# Altium schematic sheet PART2.SchDoc
size 558 x 431 mm
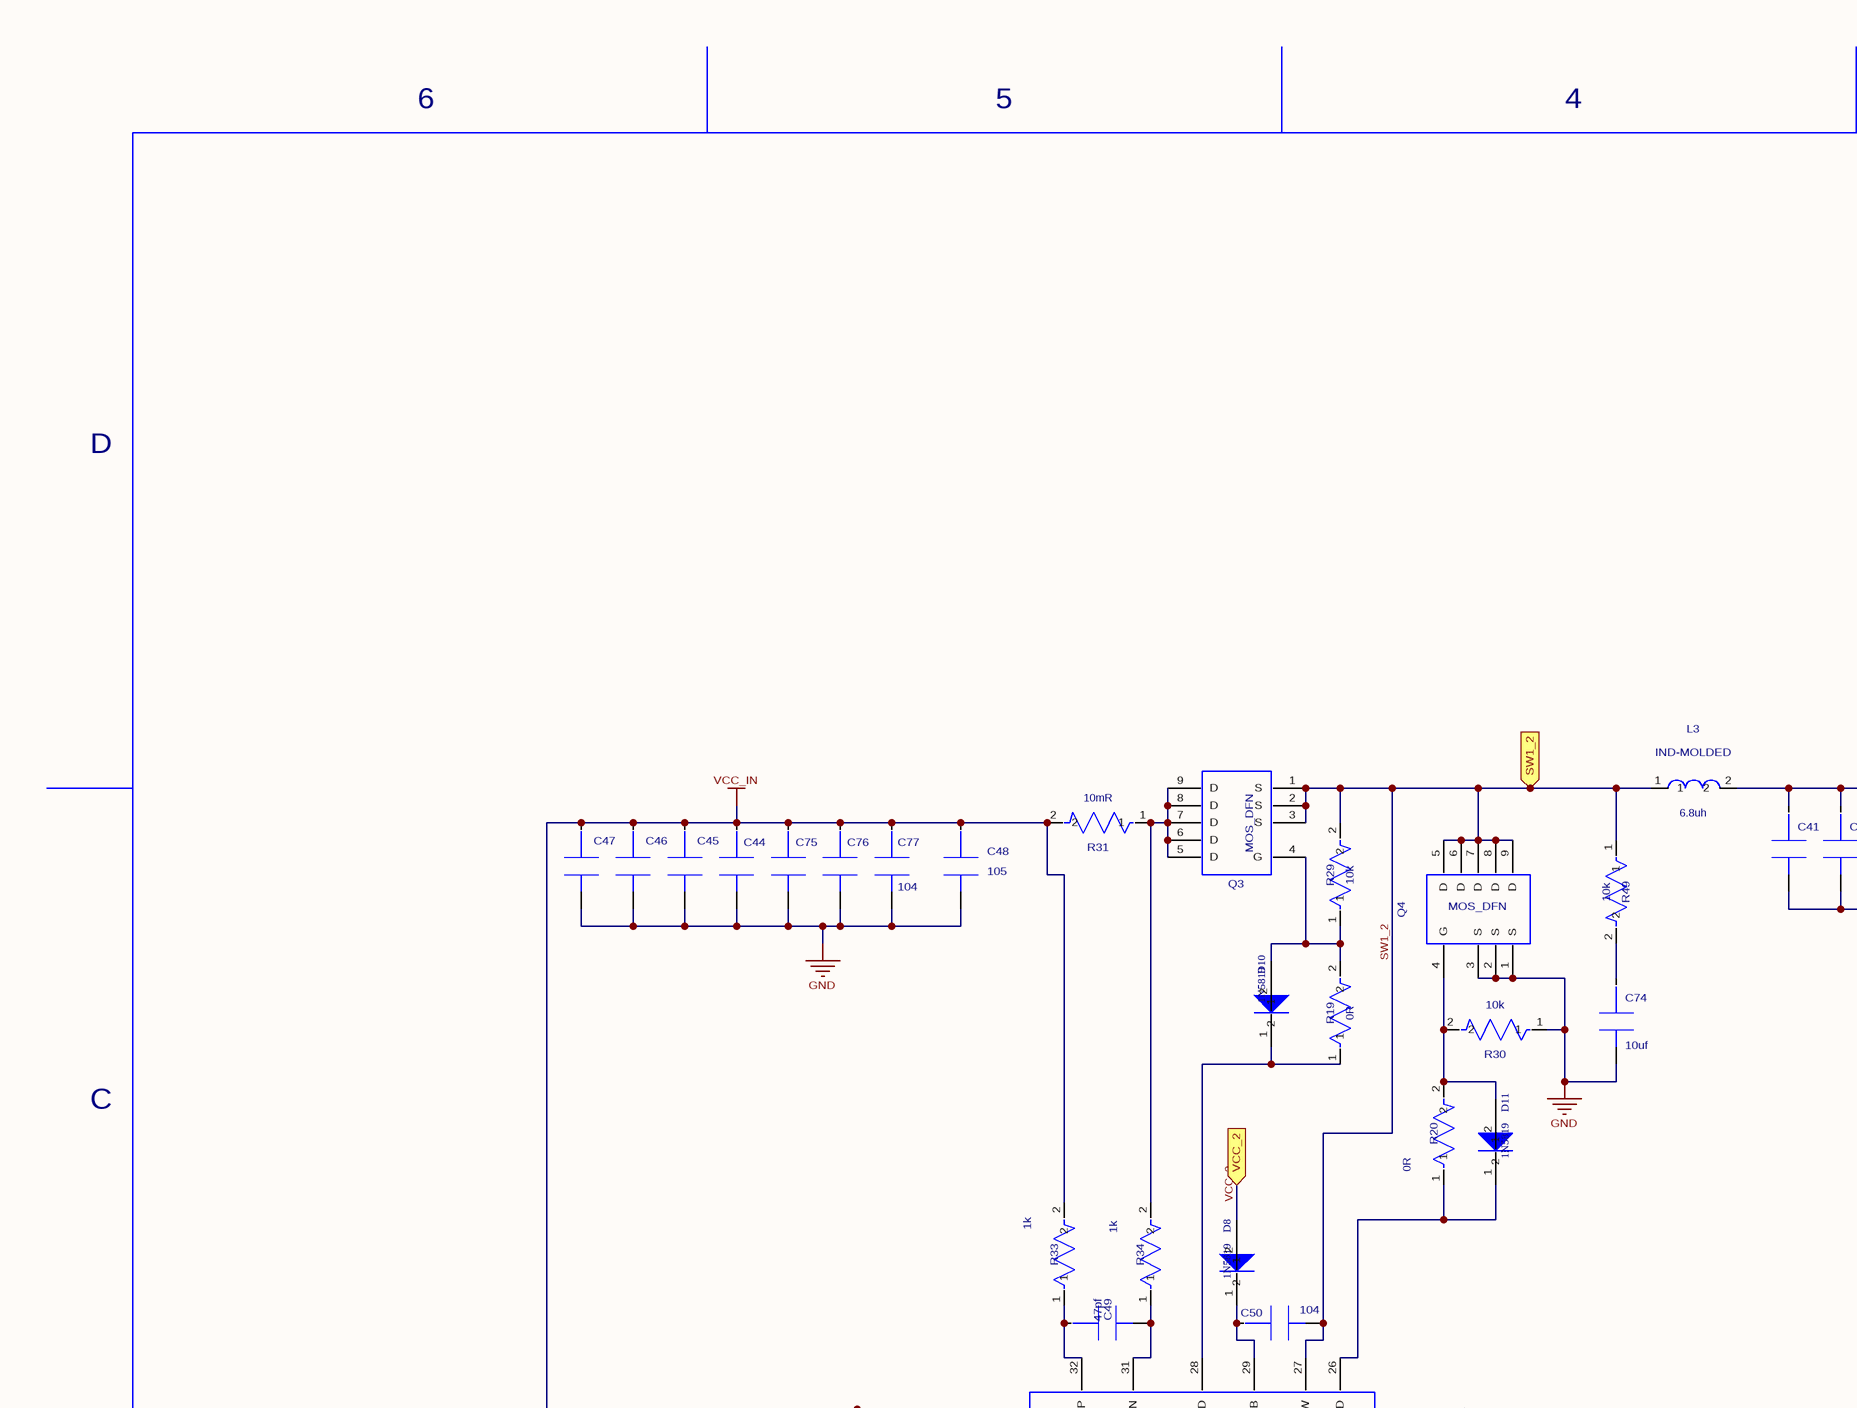
[diagram p0: PART2.SchDoc, top left]
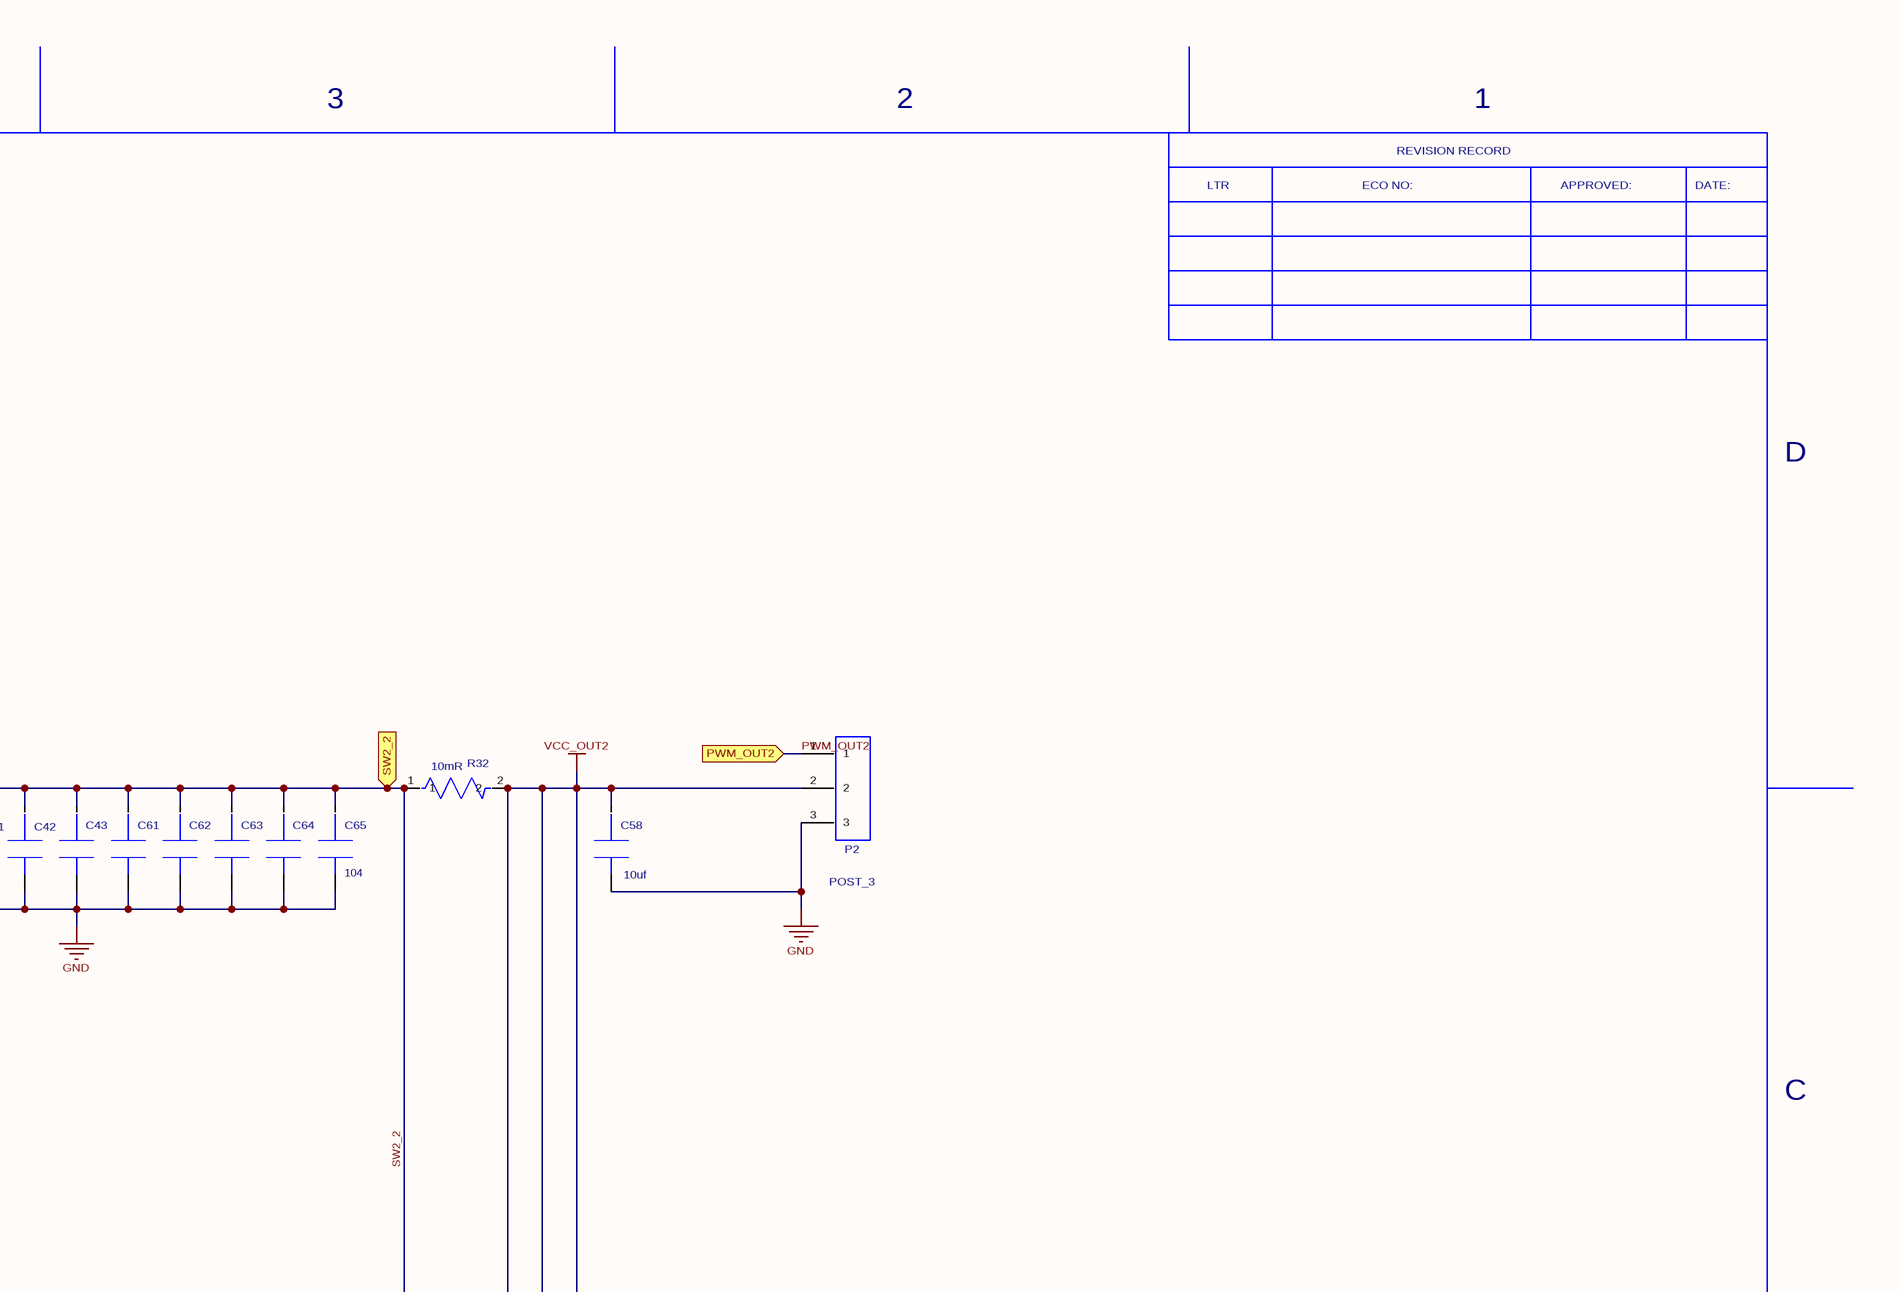
[diagram p1: PART2.SchDoc, top right]
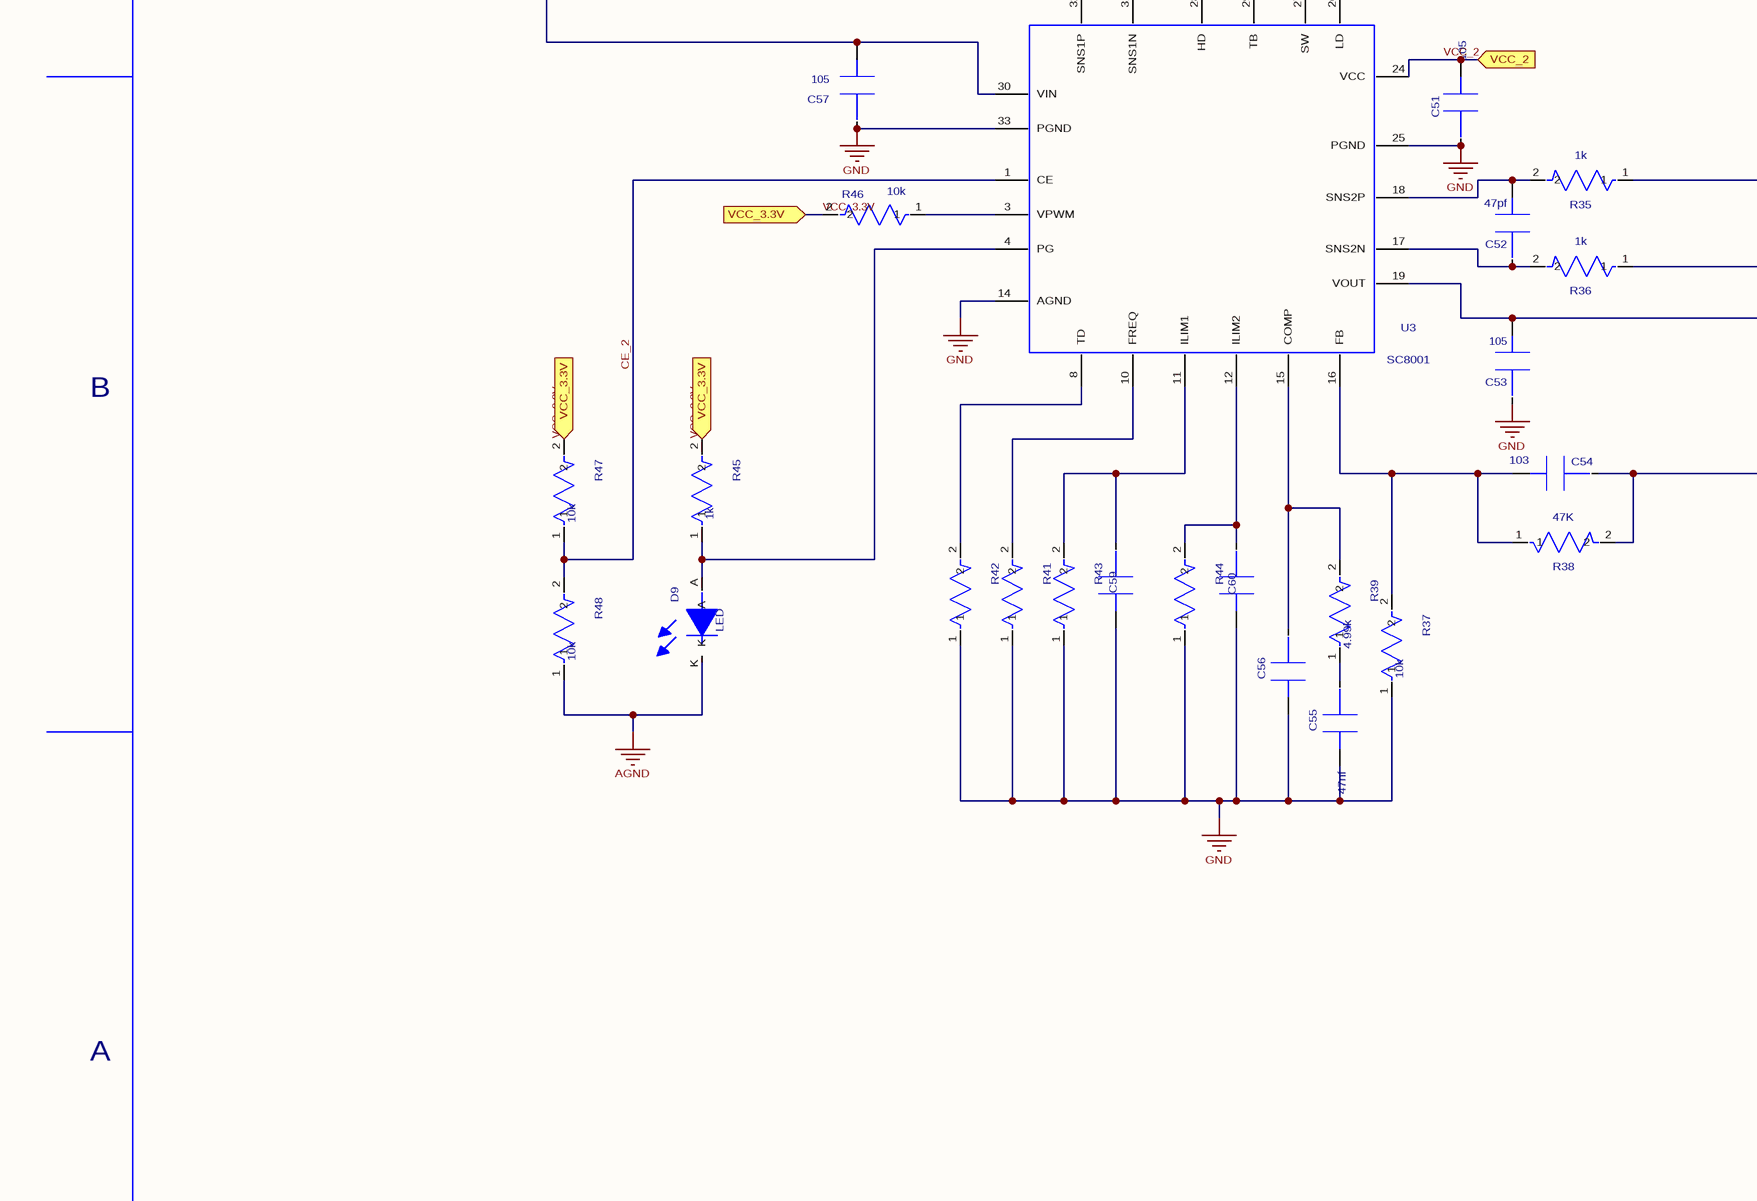
[diagram p2: PART2.SchDoc, bottom left]
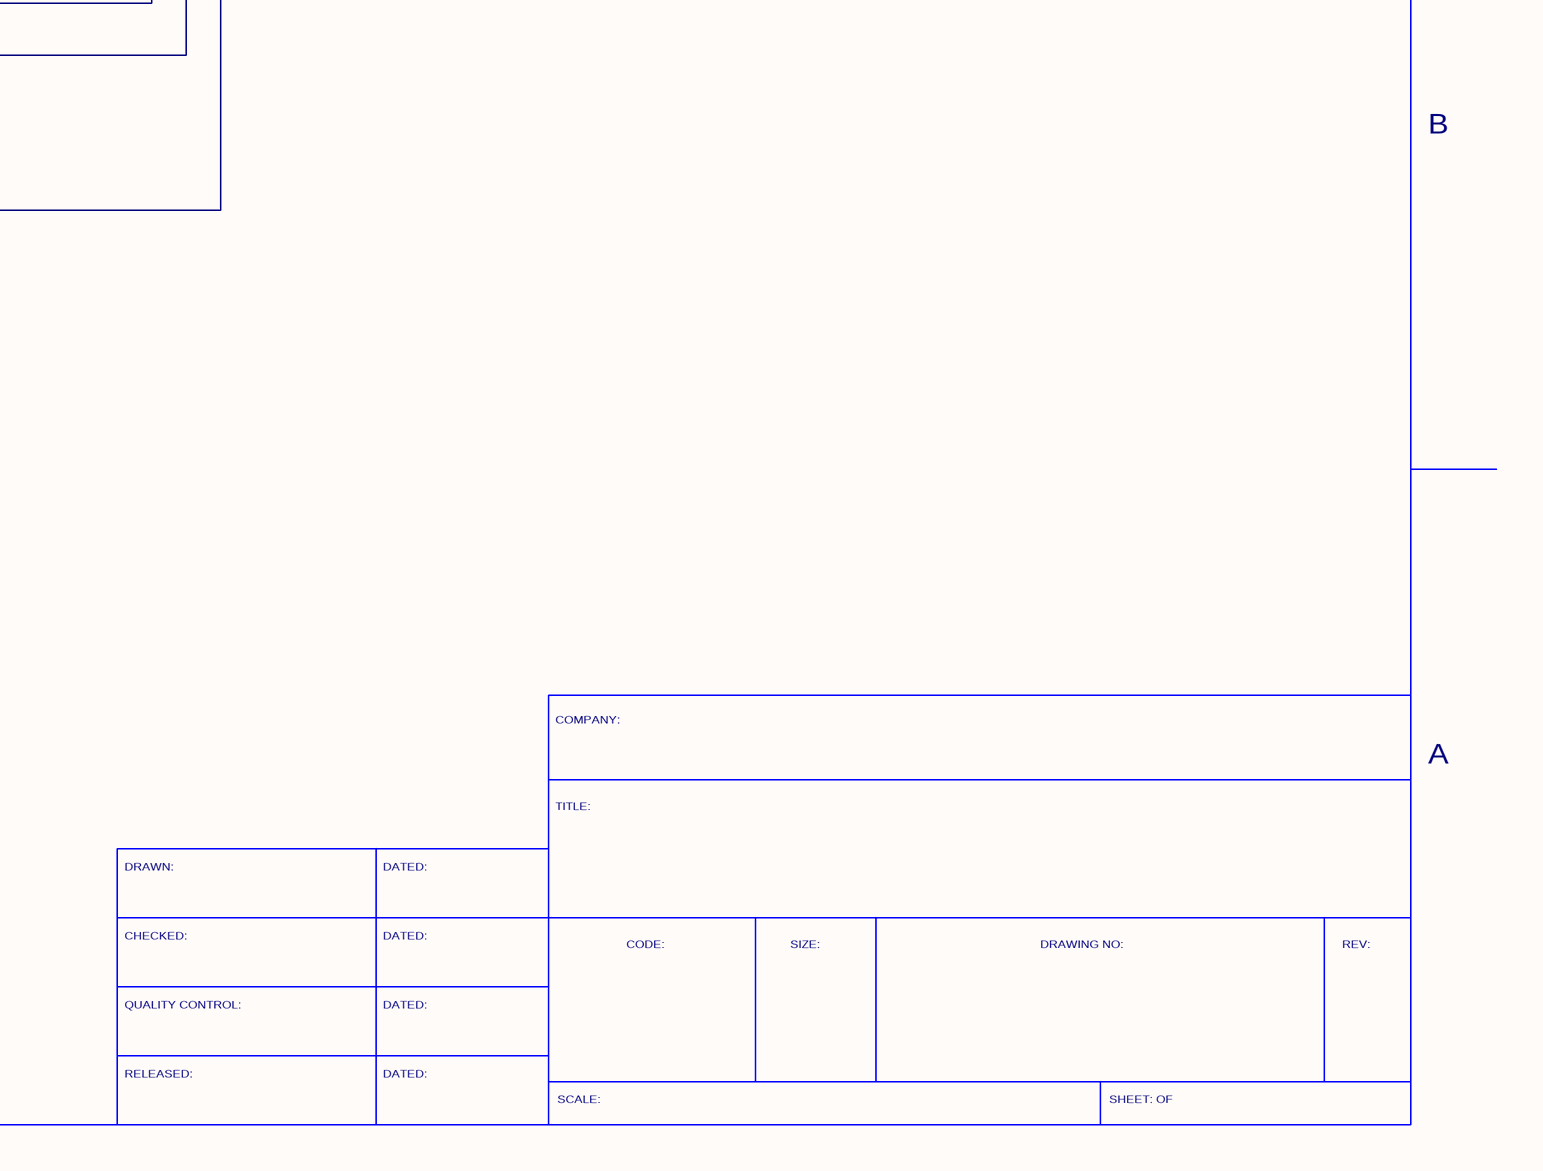
[diagram p3: PART2.SchDoc, bottom right]

## Parts
C41  CAP-AE6.3  [CC6.56.5]  (value not drawn)
C42  CAP-AE6.3  [CC6.56.5]  (value not drawn)
C43  CAP-CFR04R-C  [1206C]  (value not drawn)
C44  CAP-CFR04R-C  [1210C]  (value not drawn)
C45  CAP-CFR04R-C  [1210C]  (value not drawn)
C46  CAP-CFR04R-C  [1206C]  (value not drawn)
C47  CAP-CFR04R-C  [1210C]  (value not drawn)
C48  value 105  [0805C]  (hidden comment: CAP-CFR04R-C)
C49  value 47pf  [0603C]  (hidden comment: CAP-CFR04R-C)
C50  value 104  [0805C]  (hidden comment: CAP-CFR04R-C)
C51  value 105  [0805C]  (hidden comment: CAP-CFR04R-C)
C52  value 47pf  [0603C]  (hidden comment: CAP-CFR04R-C)
C53  value 105  [0805C]  (hidden comment: CAP-CFR04R-C)
C54  value 103  [0603C]  (hidden comment: CAP-CFR04R-C)
C55  value 47nf  [0603C]  (hidden comment: CAP-CFR04R-C)
C56  CAP-CFR04R-C  [0603C]  (value not drawn)
C57  value 105  [0805C]  (hidden comment: CAP-CFR04R-C)
C58  value 10uf  [1206C]  (hidden comment: CAP-CFR04R-C)
C59  CAP-CFR04R-C  [0603C]  (value not drawn)
C60  CAP-CFR04R-C  [0603C]  (value not drawn)
C61  CAP-CFR04R-C  [1206C]  (value not drawn)
C62  CAP-CFR04R-C  [1206C]  (value not drawn)
C63  CAP-CFR04R-C  [1206C]  (value not drawn)
C64  CAP-CFR04R-C  [1206C]  (value not drawn)
C65  value 104  [1206C]  (hidden comment: CAP-CFR04R-C)
C74  value 10uf  [0805C]  (hidden comment: CAP-CFR04R-C)
C75  CAP-CFR04R-C  [1210C]  (value not drawn)
C76  CAP-CFR04R-C  [1210C]  (value not drawn)
C77  value 104  [0805C]  (hidden comment: CAP-CFR04R-C)
D8  DIODE_1N4148  [SOD-123_L2.8-W1.8-LS3.7-RD]  (value not drawn)
D9  LED  [0805D]
D10  DIODE_1N4148  [SOD-123_L2.8-W1.8-LS3.7-RD]  (value not drawn)
D11  DIODE_1N4148  [SOD-123_L2.8-W1.8-LS3.7-RD]  (value not drawn)
L3  IND-MOLDED  value 6.8uh  [1040L]
P2  POST_3  [POST_3]
Q3  MOS_DFN  [DFN-8_5X6]
Q4  MOS_DFN  [DFN-8_5X6]
R19  value 0R  [0603R]  (hidden comment: RES-WR1)
R20  value 0R  [0603R]  (hidden comment: RES-WR1)
R29  value 10k  [0603R]  (hidden comment: RES-WR1)
R30  value 10k  [0603R]  (hidden comment: RES-WR1)
R31  value 10mR  [1206C]  (hidden comment: RES-WR1)
R32  value 10mR  [1206C]  (hidden comment: RES-WR1)
R33  value 1k  [0603R]  (hidden comment: RES-WR1)
R34  value 1k  [0603R]  (hidden comment: RES-WR1)
R35  value 1k  [0603R]  (hidden comment: RES-WR1)
R36  value 1k  [0603R]  (hidden comment: RES-WR1)
R37  value 10k  [0603R]  (hidden comment: RES-WR1)
R38  value 47K  [0603R]  (hidden comment: RES-WR1)
R39  value 4.99k  [0603R]  (hidden comment: RES-WR1)
R41  RES-WR1  [0603R]  (value not drawn)
R42  RES-WR1  [0603R]  (value not drawn)
R43  RES-WR1  [0603R]  (value not drawn)
R44  RES-WR1  [0603R]  (value not drawn)
R45  value 1k  [0805R]  (hidden comment: RES-WR1)
R46  value 10k  [0805R]  (hidden comment: RES-WR1)
R47  value 10k  [0805R]  (hidden comment: RES-WR1)
R48  value 10k  [0805R]  (hidden comment: RES-WR1)
R49  value 10k  [1206C]  (hidden comment: RES-WR1)
U3  SC8001  [QFN-32_L4.0-W4.0-P0.40-BL-EP2.7]

## Ports
PWM_OUT2, SW1_2, SW2_2, VCC_2, VCC_3.3V

## Nets
AGND: D9.K R48.1
GND: C41.2 C42.2 C43.2 C44.2 C45.2 C46.2 C47.2 C48.2 C51.1 C53.1 C55.2 C56.2 C57.1 C58.2 C59.2 C60.2 C61.2 C62.2 C63.2 C64.2 C65.2 C74.2 C75.2 C76.2 C77.2 P2.3 Q4.1(S) Q4.2(S) Q4.3(S) R30.1 R37.1 R41.1 R42.1 R43.1 R44.1 U3.14(AGND) U3.25(PGND) U3.33(PGND)
VCC_IN: C44.1 C45.1 C46.1 C47.1 C48.1 C57.2 C75.1 C76.1 C77.1 R31.2 R33.2 U3.30(VIN)
VCC_OUT2: C53.2 C54.1 C58.1 P2.2 R32.2 R36.1 R38.2 U3.19(VOUT)
CE_2: R47.1 R48.2 U3.1(CE)
PWM_OUT2: P2.1 ; port PWM_OUT2
SW1_2: C50.2 L3.1 Q3.1(S) Q3.2(S) Q3.3(S) Q4.5(D) Q4.6(D) Q4.7(D) Q4.8(D) Q4.9(D) R29.2 R49.1 U3.27(SW) ; port SW1_2
SW2_2: C41.1 C42.1 C43.1 C61.1 C62.1 C63.1 C64.1 C65.1 L3.2 R32.1 R35.1 ; port SW2_2
VCC_2: C51.2 D8.2 U3.24(VCC) ; port VCC_2
VCC_3.3V: R45.2 R46.2 R47.2 ; port VCC_3.3V
NetC49_1: C49.1 R33.1 U3.32(SNS1P)
NetC49_2: C49.2 R34.1 U3.31(SNS1N)
NetC50_1: C50.1 D8.1 U3.29(TB)
NetC52_1: C52.1 R36.2 U3.17(SNS2N)
NetC52_2: C52.2 R35.2 U3.18(SNS2P)
NetC54_2: C54.2 R37.2 R38.1 U3.16(FB)
NetC55_1: C55.1 R39.1
NetC56_1: C56.1 R39.2 U3.15(COMP)
NetC59_1: C59.1 R43.2 U3.11(ILIM1)
NetC60_1: C60.1 R44.2 U3.12(ILIM2)
NetC74_1: C74.1 R49.2
NetD9_A: D9.A R45.1 U3.4(PG)
NetD10_1: D10.1 R19.1 U3.28(HD)
NetD10_2: D10.2 Q3.4(G) R19.2 R29.1
NetD11_1: D11.1 R20.1 U3.26(LD)
NetD11_2: D11.2 Q4.4(G) R20.2 R30.2
NetQ3_5: Q3.5(D) Q3.6(D) Q3.7(D) Q3.8(D) Q3.9(D) R31.1 R34.2
NetR41_2: R41.2 U3.10(FREQ)
NetR42_2: R42.2 U3.8(TD)
NetR46_1: R46.1 U3.3(VPWM)

## Notes on the sheet
- 6
- 5
- 4
- 3
- 2
- 1
- LTR
- ECO NO:
- REVISION RECORD
- APPROVED:
- DATE:
- D
- C
- B
- COMPANY:
- A
- TITLE:
- DRAWN:
- DATED:
- CHECKED:
- CODE:
- SIZE:
- DRAWING NO:
- REV:
- QUALITY CONTROL:
- RELEASED:
- SCALE:
- SHEET: OF

## Library data of the parts
C41 C42 = CAP-AE6.3: ALUMINUM ELECTROLYTIC CAP.; Manufacturer #1: IPC SM-782 STD.; Sim.Analog.Order: Model$; Sim.Analog.Prefix: C; Value: ???; PCB DECAL: CC6.56.5
C43-C47 C61-C64 C75 C76 = CAP-CFR04R-C: RADIAL FILM CAPACITOR, MIL-SPEC SIZE CFR04R SIZE 'C'; Manufacturer #1: KEMET; Part Number: TBD; Voltage Rating: ???; Value: 10uf; Sim.Analog.Prefix: C; Sim.Analog.Order: Model$; Tolerance: ???
  C43 C46 C61-C64: PCB DECAL: 1206C
  C44 C45 C47 C75 C76: PCB DECAL: 1210C
C48-C55 C57 C58 C65 C74 C77 = CAP-CFR04R-C: RADIAL FILM CAPACITOR, MIL-SPEC SIZE CFR04R SIZE 'C'; Manufacturer #1: KEMET; Part Number: TBD; Voltage Rating: ???; Sim.Analog.Prefix: C; Sim.Analog.Order: Model$; Tolerance: ???
  C48 C50 C51 C53 C57 C74 C77: PCB DECAL: 0805C
  C49 C52 C54 C55: PCB DECAL: 0603C
  C58 C65: PCB DECAL: 1206C
C56 C59 C60 = CAP-CFR04R-C: RADIAL FILM CAPACITOR, MIL-SPEC SIZE CFR04R SIZE 'C'; Manufacturer #1: KEMET; Part Number: TBD; Voltage Rating: ???; Value: 103; Sim.Analog.Prefix: C; Sim.Analog.Order: Model$; Tolerance: ???; PCB DECAL: 0603C
D8 D10 D11 = DIODE_1N4148: High Conductance Fast Diode; ComponentLink2URL: http://www.fairchildsemi.com/ds/1N%2F1N4148.pdf; ComponentLink2Description: Datasheet; ComponentLink1URL: http://www.fairchildsemi.com/; ComponentLink1Description: Manufacturer Link; Code_JEDEC: DO-204-AH; PackageDescription: Diode, Axial; Body 3.8 x 1.9 mm (LxDia. max), Lead Dia. 0.53 mm (max); Publisher: Altium Limited; PackageReference: DO-35; DatasheetVersion: 1997; LatestRevisionNote: Re-released for DXP Platform.; LatestRevisionDate: 17-Jul-2002; Published: 8-Jun-2000; PCB DECAL: SOD-123_L2.8-W1.8-LS3.7-RD
D9 = LED: LIGHT EMITTING DIODE; Sim.Analog.Order: Model$; Sim.Analog.Prefix: D; Color: ???; PCB DECAL: 0805D
L3 = IND-MOLDED: MOLDED INDUCTOR, 0.5" PIN SPACING; Sim.Analog.Order: Model$; Sim.Analog.Prefix: L; PCB DECAL: 1040L
R19 R20 R29-R39 R45-R49 = RES-WR1: WIRE WOUND RESISTOR 3.4 X 7.05 MM; Manufacturer #1: IPC SM-782 STD.; Sim.Analog.Order: Model$; Sim.Analog.Prefix: R
  R19 R20 R29 R30 R33-R39: PCB DECAL: 0603R
  R31 R32 R49: PCB DECAL: 1206C
  R45-R48: PCB DECAL: 0805R
R41 = RES-WR1: WIRE WOUND RESISTOR 3.4 X 7.05 MM; Manufacturer #1: IPC SM-782 STD.; Sim.Analog.Order: Model$; Sim.Analog.Prefix: R; Value: 0R; PCB DECAL: 0603R
R42 = RES-WR1: WIRE WOUND RESISTOR 3.4 X 7.05 MM; Manufacturer #1: IPC SM-782 STD.; Sim.Analog.Order: Model$; Sim.Analog.Prefix: R; Value: 68k; PCB DECAL: 0603R
R43 R44 = RES-WR1: WIRE WOUND RESISTOR 3.4 X 7.05 MM; Manufacturer #1: IPC SM-782 STD.; Sim.Analog.Order: Model$; Sim.Analog.Prefix: R; Value: 10k; PCB DECAL: 0603R
P2 = POST_3: PCB DECAL: POST_3
Q3 Q4 = MOS_DFN: PCB DECAL: DFN-8_5X6
U3 = SC8001: PCB DECAL: QFN-32_L4.0-W4.0-P0.40-BL-EP2.7